# EAGLE design pihat (EAGLE 7.6.0)
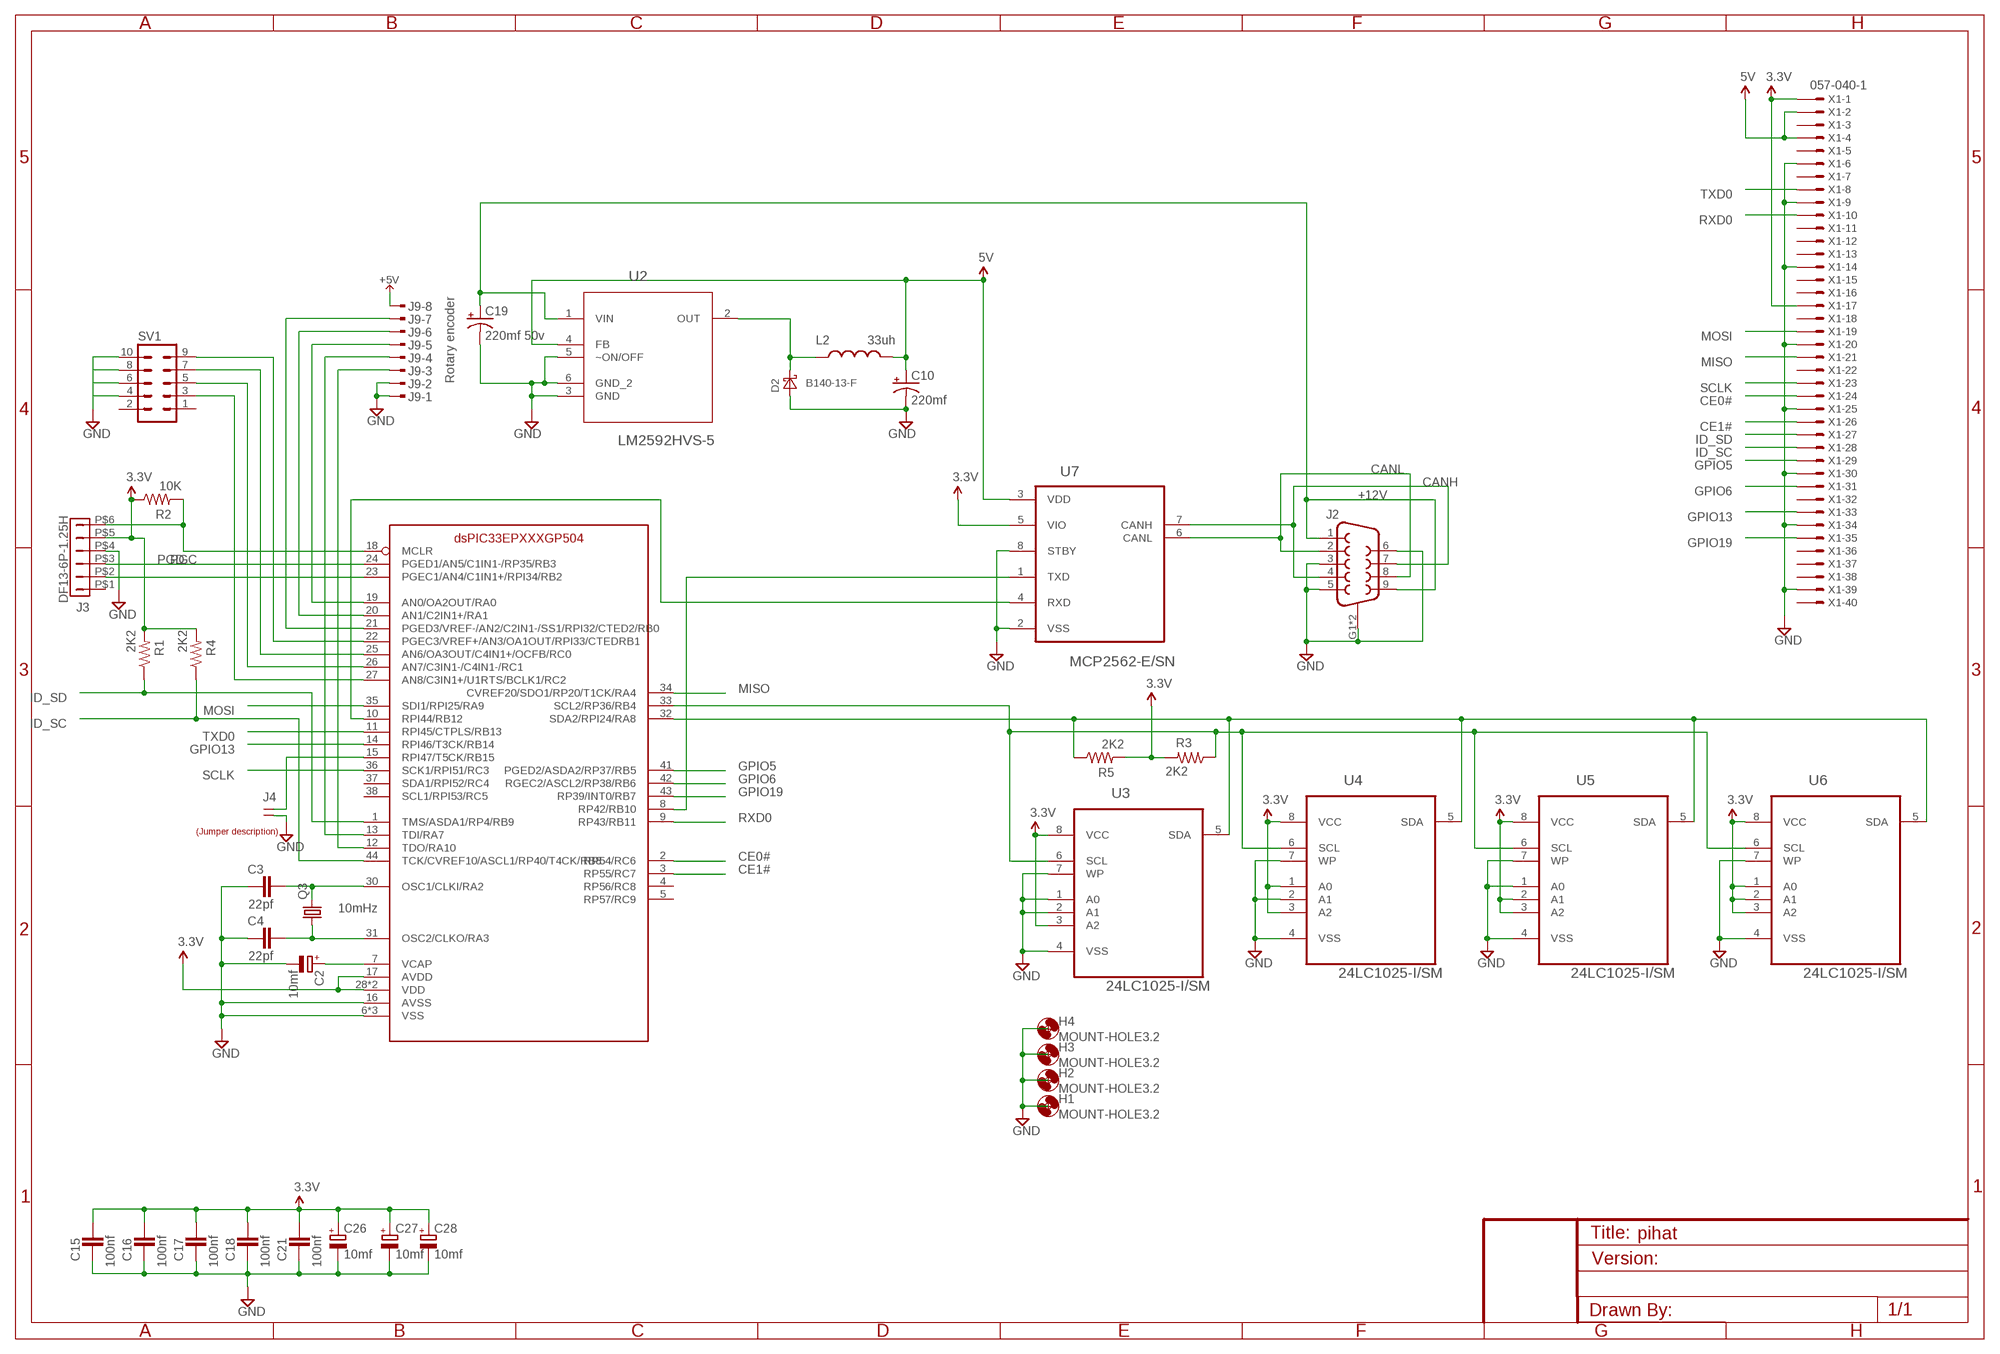
[diagram p0: schematic, sheet 1]

## Parts
C2  10mf  CAPACITOR_POL-SMC_A  [SMC_A]
C3  22pf  CAPACITOR_NPOL-0805  [C805]
C4  22pf  CAPACITOR_NPOL-0805  [C805]
C10  220mf  CAP_POL7343  [EIA7343]
C15  100nf  CAPACITOR_NPOL-0805  [C805]
C16  100nf  CAPACITOR_NPOL-0805  [C805]
C17  100nf  CAPACITOR_NPOL-0805  [C805]
C18  100nf  CAPACITOR_NPOL-0805  [C805]
C19  220mf 50v  CAP_POL7343  [EIA7343]
C21  100nf  CAPACITOR_NPOL-0805  [C805]
C26  10mf  CAPACITOR_POL-SMC_A  [SMC_A]
C27  10mf  CAPACITOR_POL-SMC_A  [SMC_A]
C28  10mf  CAPACITOR_POL-SMC_A  [SMC_A]
D2  B140-13-F  DIODE-SCHOTTKY-SMA  [SMA]
H1  MOUNT-HOLE3.2  [3,2]
H2  MOUNT-HOLE3.2  [3,2]
H3  MOUNT-HOLE3.2  [3,2]
H4  MOUNT-HOLE3.2  [3,2]
J2  DB9FEMALE  [DB9]
J3  DF13-6P-1.25H  [DF13A-6P-1.25H]
J4  JUMPER-1X2  [JUMPER-1X2]
J9  MTOP-8  [MTOP-8]
L2  33uh  INDUCTOR  [1812]
Q3  10mHz  CRYSTALHC49S  [HC49/S]
R1  2K2  RESISTOR0603-RES  [0603-RES]
R2  10K  RESISTOR0603-RES  [0603-RES]
R3  2K2  RESISTOR0603-RES  [0603-RES]
R4  2K2  RESISTOR0603-RES  [0603-RES]
R5  2K2  RESISTOR0603-RES  [0603-RES]
SV1  MA05-2  [MA05-2]
U1  DSPIC33EPXXXGP504  [TQFP44]
U2  LM2592HVS-5  LM2592HVS-5.0  [TO170P1435X457-5N]
U3  24LC1025-I/SM  [SOIC8-N_MC]
U4  24LC1025-I/SM  [SOIC8-N_MC]
U5  24LC1025-I/SM  [SOIC8-N_MC]
U6  24LC1025-I/SM  [SOIC8-N_MC]
U7  MCP2562-E/SN  [SOIC-8N]
U$1  LABEL_JUMPER_1X2  [JUMP2_DESC]
X1  057-040-1  [057-040-1]

## Nets
3.3V: C15.1 C16.1 C17.1 C18.1 C21.1 C26.+ C27.+ C28.+ J3.P$5 R1.2 R2.1 R3.2 R4.2 R5.2 U1.17(AVDD) U1.28(VDD) U1.40(VDD) U3.3(A2) U3.8(VCC) U4.1(A0) U4.3(A2) U4.8(VCC) U5.2(A1) U5.3(A2) U5.8(VCC) U6.1(A0) U6.2(A1) U6.3(A2) U6.8(VCC) U7.5(VIO) X1.1 X1.17
5V: C10.A(+) L2.2 U2.4(FB) U7.3(VDD) X1.2 X1.4
!MCLR: J3.P$6 R2.2 U1.18(MCLR)
+5V: J9.8
+12V [12v]: C19.A(+) J2.1 J2.9 U2.1(VIN)
CANH: J2.4 J2.7 U7.7(CANH)
CANL: J2.2 J2.8 U7.6(CANL)
CE0#: U1.2(RP54/RC6) X1.24
CE1#: U1.3(RP55/RC7) X1.26
GND: C2.- C3.2 C4.2 C10.C(-) C15.2 C16.2 C17.2 C18.2 C19.C(-) C21.2 C26.- C27.- C28.- D2.A J2.3 J2.5 J2.6 J2.G1(SHIELD) J2.G2(SHIELD) J3.P$4 J4.2 J9.1 J9.2 SV1.4 SV1.6 SV1.8 SV1.10 U1.6(VSS) U1.16(AVSS) U1.29(VSS) U1.39(VSS) U2.3(GND) U2.5(~ON/OFF) U2.6(GND_2) U3.1(A0) U3.2(A1) U3.4(VSS) U3.7(WP) U4.2(A1) U4.4(VSS) U4.7(WP) U5.1(A0) U5.4(VSS) U5.7(WP) U6.4(VSS) U6.7(WP) U7.2(VSS) U7.8(STBY) X1.6 X1.9 X1.14 X1.20 X1.25 X1.30 X1.34 X1.39
GPIO5: U1.41(PGED2/ASDA2/RP37/RB5) X1.29
GPIO6: U1.42(RGEC2/ASCL2/RP38/RB6) X1.31
GPIO13: U1.14(RPI46/T3CK/RB14) X1.33
GPIO19: U1.43(RP39/INT0/RB7) X1.35
ID_SC: R4.1 U1.44(TCK/CVREF10/ASCL1/RP40/T4CK/RB8) X1.28
ID_SD: R1.1 U1.1(TMS/ASDA1/RP4/RB9) X1.27
MISO: U1.34(CVREF20/SDO1/RP20/T1CK/RA4) X1.21
MOSI: U1.35(SDI1/RPI25/RA9) X1.19
N$1: J9.3 U1.12(TDO/RA10)
N$2: J9.4 U1.13(TDI/RA7)
N$3: J9.5 U1.19(AN0/OA2OUT/RA0)
N$4: J9.6 U1.20(AN1/C2IN1+/RA1)
N$5: J9.7 U1.21(PGED3/VREF-/AN2/C2IN1-/SS1/RPI32/CTED2/RB0)
N$6: SV1.9 U1.22(PGEC3/VREF+/AN3/OA1OUT/RPI33/CTEDRB1)
N$7: SV1.7 U1.25(AN6/OA3OUT/C4IN1+/OCFB/RC0)
N$8: SV1.5 U1.26(AN7/C3IN1-/C4IN1-/RC1)
N$9: SV1.3 U1.27(AN8/C3IN1+/U1RTS/BCLK1/RC2)
N$12: D2.C L2.1 U2.2(OUT)
N$19: C3.1 Q3.2 U1.30(OSC1/CLKI/RA2)
N$24: U1.10(RPI44/RB12) U7.4(RXD)
N$25: C2.+ U1.7(VCAP)
N$26: U1.8(RP42/RB10) U7.1(TXD)
N$70: C4.1 Q3.1 U1.31(OSC2/CLKO/RA3)
PGC: J3.P$2 U1.23(PGEC1/AN4/C1IN1+/RPI34/RB2)
PGD: J3.P$3 U1.24(PGED1/AN5/C1IN1-/RP35/RB3)
RESET#: J4.1 U1.15(RPI47/T5CK/RB15)
RXD0: U1.9(RP43/RB11) X1.10
SCL: R3.1 U1.33(SCL2/RP36/RB4) U3.6(SCL) U4.6(SCL) U5.6(SCL) U6.6(SCL)
SCLK: U1.36(SCK1/RPI51/RC3) X1.23
SDA: R5.1 U1.32(SDA2/RPI24/RA8) U3.5(SDA) U4.5(SDA) U5.5(SDA) U6.5(SDA)
TXD0: U1.11(RPI45/CTPLS/RB13) X1.8
Unconnected: J3.P$1 SV1.1 SV1.2 U1.4(RP56/RC8) U1.5(RP57/RC9) U1.37(SDA1/RPI52/RC4) U1.38(SCL1/RPI53/RC5) X1.3 X1.5 X1.7 X1.11 X1.12 X1.13 X1.15 X1.16 X1.18 X1.22 X1.32 X1.36 X1.37 X1.38 X1.40

## Notes on the sheet
- Rotary encoder

## Library data of the parts
C2 C26-C28 = dp_devices:CAPACITOR_POL: Polarized capacitor in various packages; PARTNO: T491A106K004AT
C3 C4 = dp_devices:CAPACITOR_NPOL: Non-Polarized capacitor in various packages; PARTNO: C0805C220J5GACTU
C10 C19 = SparkFun:CAP_POL: Capacitor Polarized These are standard SMD and PTH capacitors. Normally 10uF, 47uF, and 100uF in electrolytic and tantalum varieties. Always verify the external diameter of the through hole cap, it varies with capacity, voltage, and manufacturer. The EIA devices should be standard.; PARTNO: T545X227M016ATE035
C15-C18 C21 = dp_devices:CAPACITOR_NPOL: Non-Polarized capacitor in various packages; PARTNO: CL21F104ZBCNNNC
D2 = diode2:DIODE-SCHOTTKY-: SCHOTTKY DIODE; PARTNO: B140-13-F
H1-H4 = holes:MOUNT-HOLE: MOUNTING HOLE with drill center marker
J2 = 15pinD:DB9: DB9 Connector Standard DB9 (D-Sub 9) serial connector. Can be used for CAN bus as well as RS485 and RS232. Footprint production proven. Spark Fun Electronics SKU : PRT-00429; PARTNO: 1734354-2; PROD_ID: CONN-08194
J3 = con-hirose-df13:DF13-6P-1.25: DF13-6P 1.25mm Pitch Miniature Crimping Connector.; PARTNO: DF13A-6P-1.25H(20)
J4 = QuantumOptics:JUMPER-1X2: Jumper, header, SIP on 0.1" grid, for option selection.; PARTNO: M20-9770246
J9 = con-amp:MTOP-8: AMP connector; PARTNO: 7-215079-8
L2 = SparkFun:INDUCTOR: Inductors Basic Inductor/Choke - 0603 and 1206. Footprints are not proven and vary greatly between part numbers.; PARTNO: LQH43MN330K03L
Q3 = crystal:CRYSTAL: CRYSTAL; OC_FARNELL: 1667008; OC_NEWARK: unknown; PARTNO: ATS100B-E
R1 R3-R5 = SparkFun-Passives:RESISTOR: Resistor Basic schematic elements and footprints for 0603, 1206, and PTH resistors.; PARTNO: RC0603FR-072K2L
R2 = SparkFun-Passives:RESISTOR: Resistor Basic schematic elements and footprints for 0603, 1206, and PTH resistors.; PARTNO: RC0603FR-0710KL
SV1 = con-lstb:MA05-2: PIN HEADER; OC_FARNELL: unknown; OC_NEWARK: unknown
U1 = microchip-dspic:DSPIC33EPXXXGP504; PARTNO: DSPIC33EP512GP504-I/PT
U2 = NSC_By_element14_Batch_1.1:LM2592HVS-5.0: SIMPLE SWITCHER; MPN: LM2592HVS-5.0; OC_FARNELL: -; OC_NEWARK: 41K3791; PACKAGE: TO-263-5; PARTNO: LM2592HVSX-3.3/NOPB; SUPPLIER: National Semiconductor
U3-U6 = Microchip_By_element14_Batch_1:24LC1025-I/SM: 1024K I2C CMOS Serial EEPROM; PARTNO: 24LC1025T-I/SN
U7 = Microchip-MCP2562-E_SN:MCP2562-E/SN: High-Speed CAN Transceiver,SOIC-8; PARTNO: MCP2562-E/SN
U$1 = dp_devices:LABEL_JUMPER_1X2: Nice formatted two legged jumperdescription Use attributes to change the values ON = With jumper OFF = Without jumper; OFF: Normal; ON: Reset
X1 = con-panduit-changed:057-040-: CONNECTOR 40-pin series 057 contact pc board low profile headers; OC_FARNELL: unknown; OC_NEWARK: unknown

## Net classes
2 12v: width 0.152 mm, drill 0.305 mm, clearance 0.305 mm

## Board
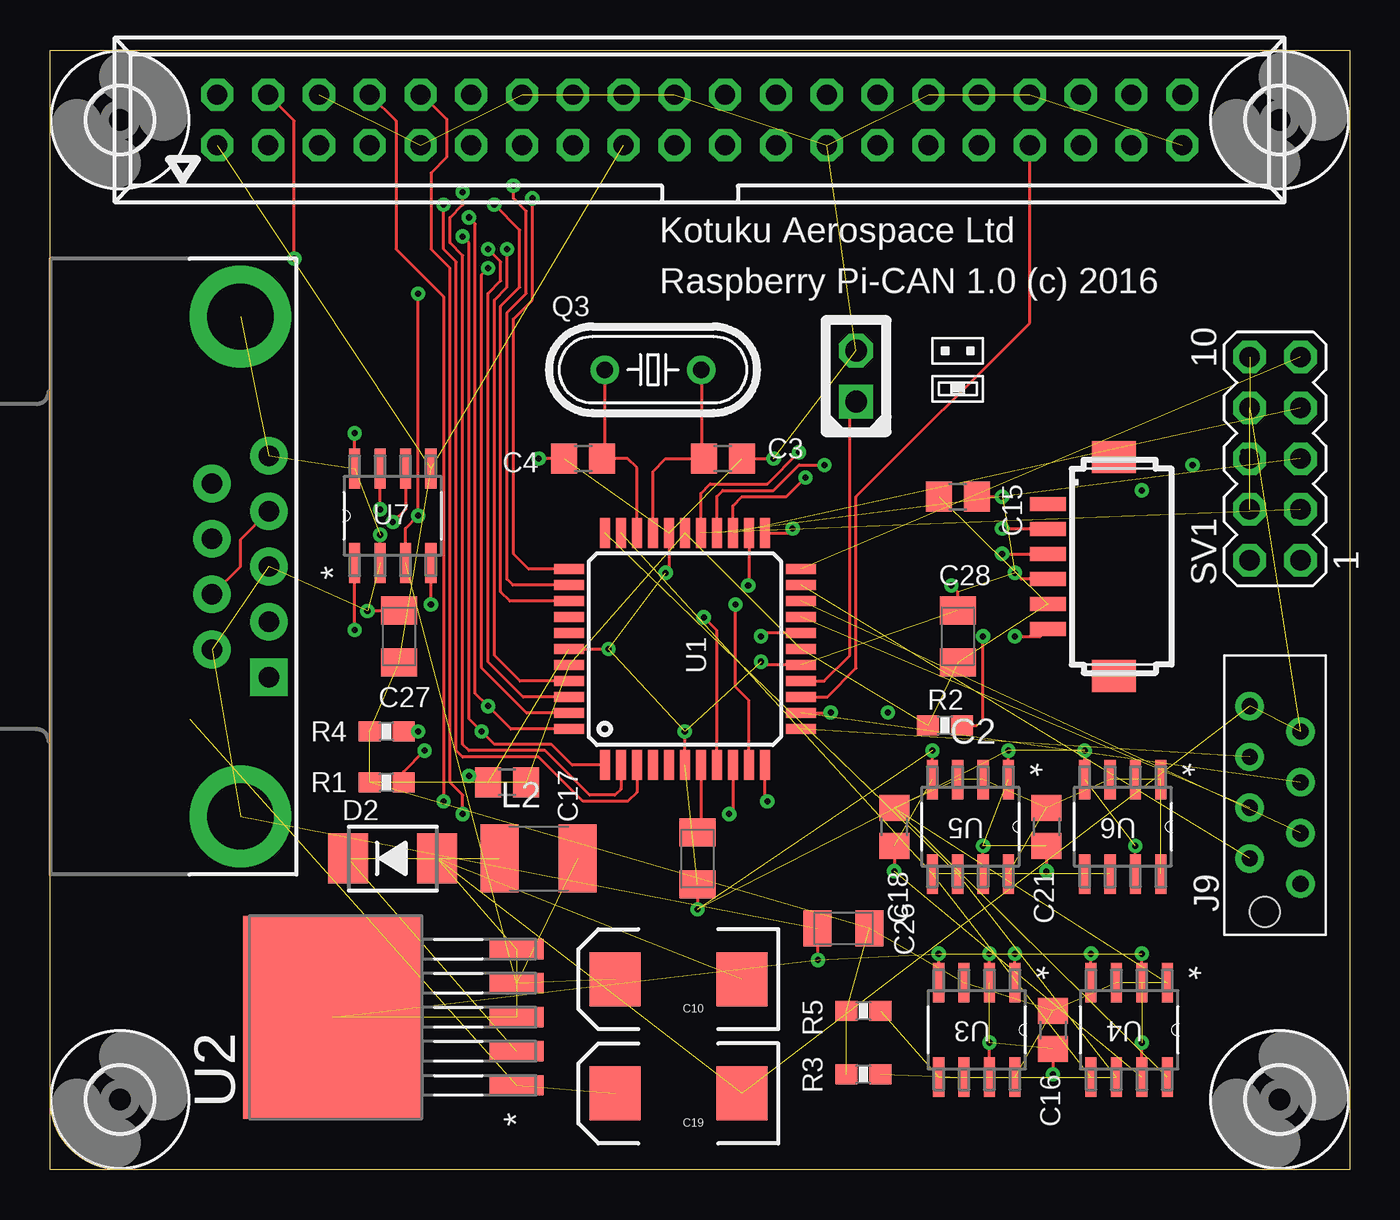
[diagram p1: board, top side]
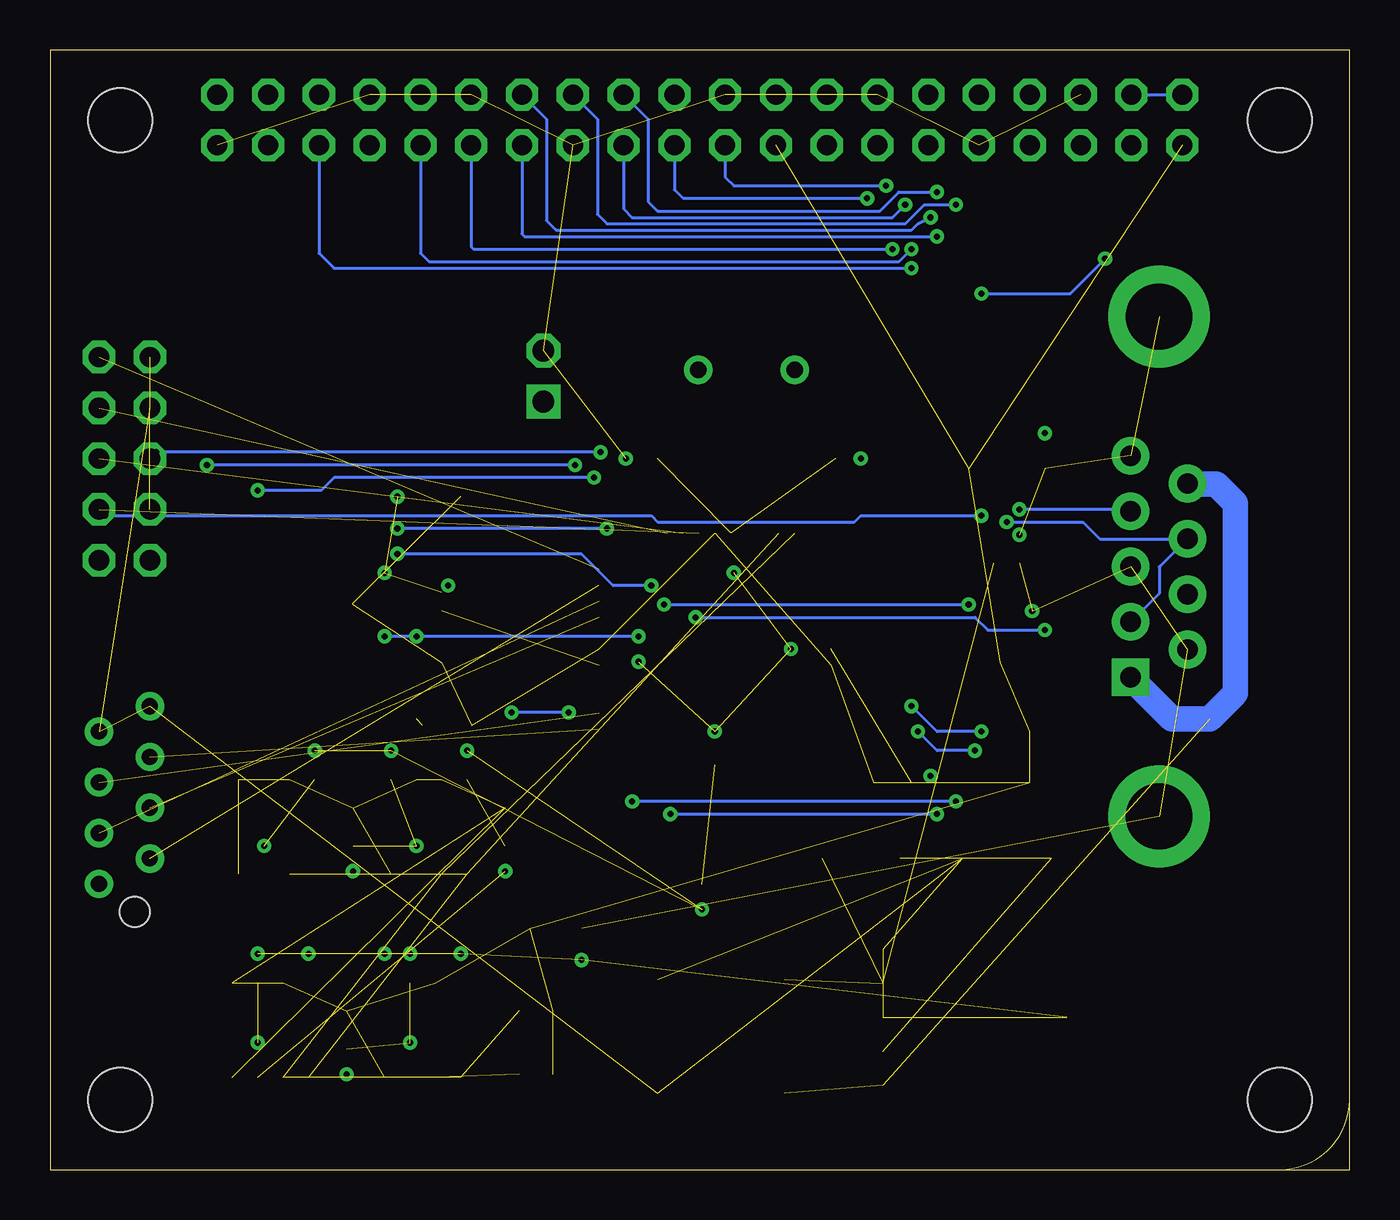
[diagram p2: board, bottom side, seen from below]

Size 65 x 56 mm. Coordinates in mm from the lower left corner, seen from the top.
Outline: 0,3.49 0,0 3.49,0
Outline: 0,3.49 0,56 65,56 65,0 3.49,0
Outline: 3.49,0 arc-90 0,3.49
Copper layers (1*16): Top 0.035mm / dielectric 1.5mm / Bottom 0.035mm
Design rules "DFRobot_Eagle_Rule_v0.4": minimum track width 6mil, minimum drill 12mil, track to track 6mil, track to pad 6mil, pad to pad 6mil, via to via 6mil, smd to smd 0mil, copper to edge 10mil, drill to drill 10mil, minimum pad ring 12mil, minimum via ring 8mil, stop-mask expansion 2mil, vias tented up to drill 25mil, thermal gap 10mil

### Footprints (pad centres in the part's own frame; a part is rotated, then mirrored left to right if it is on the bottom)
SMC_A = smd 1.4 x 1.8: + -1.3,0; - 1.3,0
C805 = smd 1.3 x 1.5: 1 -0.95,0; 2 0.95,0
EIA7343 = smd 2.55 x 2.7: A 3.17,0; C -3.17,0
SMA = smd 2 x 2.5: A 2.223,0; C -2.223,0
3,2 = hole 3.2: 0,0
DB9 = drill 1.016 pad 1.88 square: 1 -5.54,-1.42 | drill 1.016 pad 1.88: 2 -2.77,-1.42; 3 0,-1.42; 4 2.77,-1.42; 5 5.54,-1.42; 6 -4.15,1.42; 7 -1.38,1.42; 8 1.38,1.42; 9 4.15,1.42 | drill 3.302 pad 5.08: G1 -12.5,0; G2 12.5,0
DF13A-6P-1.25H = smd 1.6 x 2.2: M$0 -5.475,2.4; M$1 5.475,2.4 | smd 0.7 x 1.8: P$1 -3.125,-0.9; P$2 -1.875,-0.9; P$3 -0.625,-0.9; P$4 0.625,-0.9; P$5 1.875,-0.9; P$6 3.125,-0.9
JUMPER-1X2 = drill 1.092 square: 1 0,2.54 | drill 1.092 octagon: 2 0,0
MTOP-8 = drill 0.813: 1 4.445,1.27; 2 3.175,-1.27; 3 1.905,1.27; 4 0.635,-1.27; 5 -0.635,1.27; 6 -1.905,-1.27; 7 -3.175,1.27; 8 -4.445,-1.27 | hole 1.5: -5.842,0.508
1812 = smd 1.9 x 3.4: 1 -1.95,0; 2 1.95,0
HC49/S = drill 0.813: 1 -2.413,0; 2 2.413,0
0603-RES = smd 1.1 x 1: 1 -0.85,0; 2 0.85,0
MA05-2 = drill 1.016 octagon: 1 -5.08,-1.27; 2 -5.08,1.27; 3 -2.54,-1.27; 4 -2.54,1.27; 5 0,-1.27; 6 0,1.27; 7 2.54,-1.27; 8 2.54,1.27; 9 5.08,-1.27; 10 5.08,1.27
TQFP44 = smd 1.5 x 0.5: 1 -5.8,4; 2 -5.8,3.2; 3 -5.8,2.4; 4 -5.8,1.6; 5 -5.8,0.8; 6 -5.8,0; 7 -5.8,-0.8; 8 -5.8,-1.6; 9 -5.8,-2.4; 10 -5.8,-3.2; 11 -5.8,-4; 23 5.8,-4; 24 5.8,-3.2; 25 5.8,-2.4; 26 5.8,-1.6; 27 5.8,-0.8; 28 5.8,0; 29 5.8,0.8; 30 5.8,1.6; 31 5.8,2.4; 32 5.8,3.2; 33 5.8,4 | smd 0.5 x 1.5: 12 -4,-5.8; 13 -3.2,-5.8; 14 -2.4,-5.8; 15 -1.6,-5.8; 16 -0.8,-5.8; 17 0,-5.8; 18 0.8,-5.8; 19 1.6,-5.8; 20 2.4,-5.8; 21 3.2,-5.8; 22 4,-5.8; 34 4,5.8; 35 3.2,5.8; 36 2.4,5.8; 37 1.6,5.8; 38 0.8,5.8; 39 0,5.8; 40 -0.8,5.8; 41 -1.6,5.8; 42 -2.4,5.8; 43 -3.2,5.8; 44 -4,5.8
TO170P1435X457-5N = smd 1.016 x 2.692: 1 -3.404,-9.042; 2 -1.702,-9.042; 3 0,-9.042; 4 1.702,-9.042; 5 3.404,-9.042 | smd 10.16 x 8.941: 6 0,0.152
SOIC8-N_MC = smd 1.981 x 0.559: 1 -2.362,1.905; 2 -2.362,0.635; 3 -2.362,-0.635; 4 -2.362,-1.905; 5 2.362,-1.905; 6 2.362,-0.635; 7 2.362,0.635; 8 2.362,1.905
SOIC-8N = smd 1.981 x 0.559: 1 1.448,5.715; 2 1.448,4.445; 3 1.448,3.175; 4 1.448,1.905; 5 6.172,1.905; 6 6.172,3.175; 7 6.172,4.445; 8 6.172,5.715
057-040-1 = drill 1 octagon: 1 -24.13,-1.27; 2 -24.13,1.27; 3 -21.59,-1.27; 4 -21.59,1.27; 5 -19.05,-1.27; 6 -19.05,1.27; 7 -16.51,-1.27; 8 -16.51,1.27; 9 -13.97,-1.27; 10 -13.97,1.27; 11 -11.43,-1.27; 12 -11.43,1.27; 13 -8.89,-1.27; 14 -8.89,1.27; 15 -6.35,-1.27; 16 -6.35,1.27; 17 -3.81,-1.27; 18 -3.81,1.27; 19 -1.27,-1.27; 20 -1.27,1.27; 21 1.27,-1.27; 22 1.27,1.27; 23 3.81,-1.27; 24 3.81,1.27; 25 6.35,-1.27; 26 6.35,1.27; 27 8.89,-1.27; 28 8.89,1.27; 29 11.43,-1.27; 30 11.43,1.27; 31 13.97,-1.27; 32 13.97,1.27; 33 16.51,-1.27; 34 16.51,1.27; 35 19.05,-1.27; 36 19.05,1.27; 37 21.59,-1.27; 38 21.59,1.27; 39 24.13,-1.27; 40 24.13,1.27

### Placement (x,y rotation side)
C2  32.38,15.56 270 top
C3  33.66,35.56 0 top
C4  26.67,35.56 180 top
C10  31.43,9.53 180 top
C15  45.4,33.66 0 top
C16  50.16,6.99 270 top
C17  22.86,19.37 180 top
C18  42.23,17.14 270 top
C19  31.43,3.81 180 top
C21  49.85,17.14 270 top
C26  39.69,12.06 180 top
C27  17.46,26.67 90 top
C28  45.4,26.67 90 top
D2  17.14,15.56 0 top
H1  61.5,3.5 0 top
H2  3.5,3.5 0 top
H3  3.5,52.5 0 top
H4  61.5,52.5 0 top
J2  9.53,30.16 90 top
J3  50.8,30.16 270 top
J4  40.32,40.96 180 top
J9  61.28,18.73 90 top
L2  24.45,15.56 0 top
Q3  30.16,40.01 0 top
R1  16.83,19.37 180 top
R2  44.77,22.23 0 top
R3  40.69,4.76 180 top
R4  16.83,21.91 180 top
R5  40.69,7.94 180 top
SV1  61.28,35.56 90 top
U1  31.75,26.04 90 top
U2  14.29,7.62 90 top
U3  46.35,6.99 270 top
U4  53.98,6.99 270 top
U5  46.04,17.14 270 top
U6  53.66,17.14 270 top
U7  20.95,28.89 90 top
U$1  47.94,39.69 0 top
X1  32.5,52.5 0 top

### Tracks (layer width: path | path; a pad name or v marks a point on that pad's centre or on a via)
3.3V  (31 unrouted)
5V  (via drill 0.3)  (3 unrouted)
  Top 0.152: U7.3 17.78,32.07 v18.41,32.7 v18.41,43.81 | v12.22,45.56 12.22,52.46 X1.4
  Bottom 0.152: v18.41,43.81 13.97,43.81 v12.22,45.56 | X1.4 X1.2 | v62.23,32.7 34.92,32.7 34.61,32.38 24.77,32.38 24.45,32.7 v18.41,32.7
!MCLR  (via drill 0.3)  (1 unrouted)
  Top 0.152: U1.18 35.73,26.84 v35.56,26.67 | v48.26,26.67 49.53,26.67 J3.P$6 | R2.2 46.35,22.23 | 46.67,22.54 v46.67,26.67
  Bottom 0.152: v35.56,26.67 v46.67,26.67 v48.26,26.67
+12V  (2 unrouted)
  Bottom 1.27: J2.1 10.95,24.6 8.89,22.54 6.99,22.54 5.71,23.81 5.71,33.34 6.67,34.29 8.08,34.29 J2.9
CANH  (via drill 0.3)
  Top 0.152: v16.51,33.02 U7.7 | J2.7 8.14,28.78 9.53,30.16 9.53,31.51 J2.4
  Bottom 0.152: 10.95,32.85 J2.4 11.03,33.02 v16.51,33.02
CANL  (via drill 0.3)
  Top 0.152: U7.6 17.78,33.02 v17.14,32.38
  Bottom 0.152: J2.2 9.53,28.81 9.53,30.16 9.48,30.16 J2.8 12.49,31.54 13.34,32.38 v17.14,32.38
CE0#  (via drill 0.3)
  Top 0.152: U1.2 28.55,19.07 28.57,19.05 28.26,18.73 26.99,18.73 24.77,20.95 20.95,20.95 20.64,21.27 20.64,45.72 20,46.35 20,47.62 20.64,48.26 v20.64,48.9
  Bottom 0.152: X1.24 35.08,52.55 35.08,48.42 34.61,47.94 23.5,47.94 22.54,48.9 v20.64,48.9
CE1#  (via drill 0.3)
  Top 0.152: U1.3 29.35,18.87 28.89,18.41 26.67,18.41 24.45,20.64 20.64,20.64 20.32,20.95 20.32,45.4 19.68,46.04 v19.68,48.26
  Bottom 0.152: X1.26 37.62,52.55 37.62,47.78 37.15,47.31 22.23,47.31 21.27,48.26 v19.68,48.26
GND  (via drill 0.3)  (55 unrouted)
  Top 0.152: U7.8 v15.24,36.83 | U7.2 v16.51,31.75 | C27.- 17.43,27.94 v15.88,27.94 | C17.2 v20.95,19.68 | U1.39 v27.94,26.04 | U1.29 30.95,30 v30.8,29.84 | U1.16 35.73,25.23 v35.56,25.4 | U1.6 v31.75,21.91 | J3.P$4 48.57,29.54 v48.26,29.84 | C28.- 45.4,28.89 v45.09,29.21 | C15.2 v47.62,33.66 | C26.- 38.39,10.51 v38.42,10.48 | U3.4 v44.45,10.79 | U3.2 v46.99,10.79 | U3.1 v48.26,10.79 | U3.7 v46.99,6.35 | C16.2 v50.16,4.76 | U4.4 v52.07,10.79 | U4.2 v54.61,10.79 | C18.2 v42.23,14.92 | U4.7 v54.61,6.35 | U5.4 v44.13,20.95 | U5.1 v47.94,20.95 | U5.7 v46.67,16.19 | C21.2 v49.85,14.92 | U6.4 v51.75,20.95 | U6.7 v54.29,16.19 | C2.- v32.38,13.02 | C3.2 v36.2,35.56 | C4.2 v24.45,35.56
GPIO5  (via drill 0.3)
  Top 0.152: U1.41 23.51,24.43 22.23,25.72 22.23,43.5 22.86,44.13 v22.86,46.04
  Bottom 0.152: X1.29 43.93,46.15 43.81,46.04 v22.86,46.04
GPIO6  (via drill 0.3)
  Top 0.152: U1.42 23.67,23.64 21.91,25.4 21.91,43.81 22.54,44.45 22.54,45.4 v21.91,46.04
  Bottom 0.152: X1.31 46.47,45.84 46.04,45.4 22.54,45.4 v21.91,46.04
GPIO13
  Top 0.152: U1.14 38.88,23.64 40.32,25.08 40.32,33.66 49.01,42.34 X1.33
GPIO19  (via drill 0.3)
  Top 0.152: U1.43 23.84,22.84 21.59,25.08 21.59,44.77 v21.91,45.09
  Bottom 0.152: X1.35 51.55,45.84 50.8,45.09 v21.91,45.09
ID_SC  (via drill 0.3)
  Top 0.152: U1.44 23.05,22.04 v21.91,23.18 21.27,23.81 21.27,47.31 v20.95,47.62 | R4.1 v18.41,21.91
  Bottom 0.152: X1.28 40.16,52.55 40.16,47.47 39.69,46.99 21.91,46.99 21.59,47.31 v20.95,47.62 | v18.41,21.91 20.64,21.91 v21.91,23.18
ID_SD  (via drill 0.3)
  Top 0.152: U1.1 26.12,20.23 25.08,21.27 22.23,21.27 v21.59,21.91 20.95,22.54 20.95,46.35 v20.64,46.67 | R1.1 17.68,19.9 v18.73,20.95
  Bottom 0.152: X1.27 41.39,46.79 41.27,46.67 v20.64,46.67 | v18.73,20.95 20.64,20.95 v21.59,21.91
MISO  (via drill 0.3)
  Top 0.152: U1.34 23.94,30.04 23.18,30.8 23.18,42.55 24.13,43.5 v24.13,48.58
  Bottom 0.152: X1.21 33.77,49.01 33.34,48.58 v24.13,48.58
MOSI  (via drill 0.3)
  Top 0.152: U1.35 23.15,29.23 22.86,29.53 22.86,42.86 23.81,43.81 23.81,47.94 23.18,48.58 v23.18,49.21
  Bottom 0.152: X1.19 31.23,49.65 30.8,49.21 v23.18,49.21
N$1  (1 unrouted)
N$2  (via drill 0.3)  (1 unrouted)
  Top 0.152: U1.13 39.03,22.84 v39.05,22.86
  Bottom 0.152: v39.05,22.86 v41.91,22.86
N$3  (1 unrouted)
N$4  (1 unrouted)
N$5  (1 unrouted)
N$6  (1 unrouted)
N$7  (via drill 0.3)  (1 unrouted)
  Top 0.152: U1.25 34.15,33.2 34.61,33.66 36.83,33.66 v37.78,34.61
  Bottom 0.152: v37.78,34.61 50.8,34.61 51.44,33.97 v54.61,33.97
N$8  (via drill 0.3)  (1 unrouted)
  Top 0.152: U1.26 33.35,33.67 33.66,33.97 36.2,33.97 37.47,35.24 v38.73,35.24
  Bottom 0.152: v38.73,35.24 v57.15,35.24
N$9  (via drill 0.3)  (1 unrouted)
  Top 0.152: U1.27 32.55,33.82 33.02,34.29 35.88,34.29 v37.47,35.88
  Bottom 0.152: v37.47,35.88 v59.69,35.88
N$12  (2 unrouted)
N$19
  Top 0.152: Q3.2 32.58,35.69 C3.1 30.8,35.56 30.15,34.91 U1.30
N$24  (via drill 0.3)
  Top 0.152: U1.10 34.95,23.47 34.29,24.13 v34.29,28.26 | v19.05,28.26 U7.4
  Bottom 0.152: v34.29,28.26 v19.05,28.26
N$25
  Top 0.152: U1.7 32.55,17.02 C2.+
N$26  (via drill 0.3)
  Top 0.152: U1.8 33.35,26.98 v32.7,27.62 | v15.24,26.99 U7.1
  Bottom 0.152: v32.7,27.62 18.73,27.62 18.1,26.99 v15.24,26.99
N$70
  Top 0.152: Q3.1 27.75,35.69 C4.1 28.89,35.56 29.35,35.1 U1.31
PGC  (via drill 0.3)
  Top 0.152: U1.23 36.91,31.84 v37.15,32.07 | v47.62,32.07 49.87,32.07 J3.P$2
  Bottom 0.152: v37.15,32.07 v47.62,32.07
PGD  (via drill 0.3)
  Top 0.152: U1.24 34.95,29.23 v34.92,29.21 | v47.62,30.8 J3.P$3
  Bottom 0.152: v34.92,29.21 36.83,29.21 38.42,30.8 v47.62,30.8
RESET#
  Top 0.152: U1.15 38.72,24.43 40.01,25.72 40.01,38.1 J4.1
RXD0  (via drill 0.3)
  Top 0.152: X1.10 18.62,53.77 19.84,52.55 19.84,50.64 19.05,49.85 19.05,46.04 20,45.09 20,19.37 20.64,18.73 v20.64,17.78 | U1.9 34.15,17.96 v33.97,17.78
  Bottom 0.152: v33.97,17.78 v20.64,17.78
SCL  (5 unrouted)
SCLK  (via drill 0.3)
  Top 0.152: U1.36 23,28.43 22.54,28.89 22.54,43.18 23.5,44.13 23.5,46.99 v22.23,48.26
  Bottom 0.152: X1.23 36.31,48.06 35.88,47.62 22.86,47.62 v22.23,48.26
SDA  (5 unrouted)
TXD0  (via drill 0.3)
  Top 0.152: X1.8 17.3,52.46 17.3,46.04 19.68,43.66 v19.68,18.41 | v35.88,18.41 35.75,18.54 U1.11
  Bottom 0.152: v19.68,18.41 v35.88,18.41

### Text on the board
tPlace: Kotuku Aerospace Ltd | Raspberry Pi-CAN 1.0 (c) 2016